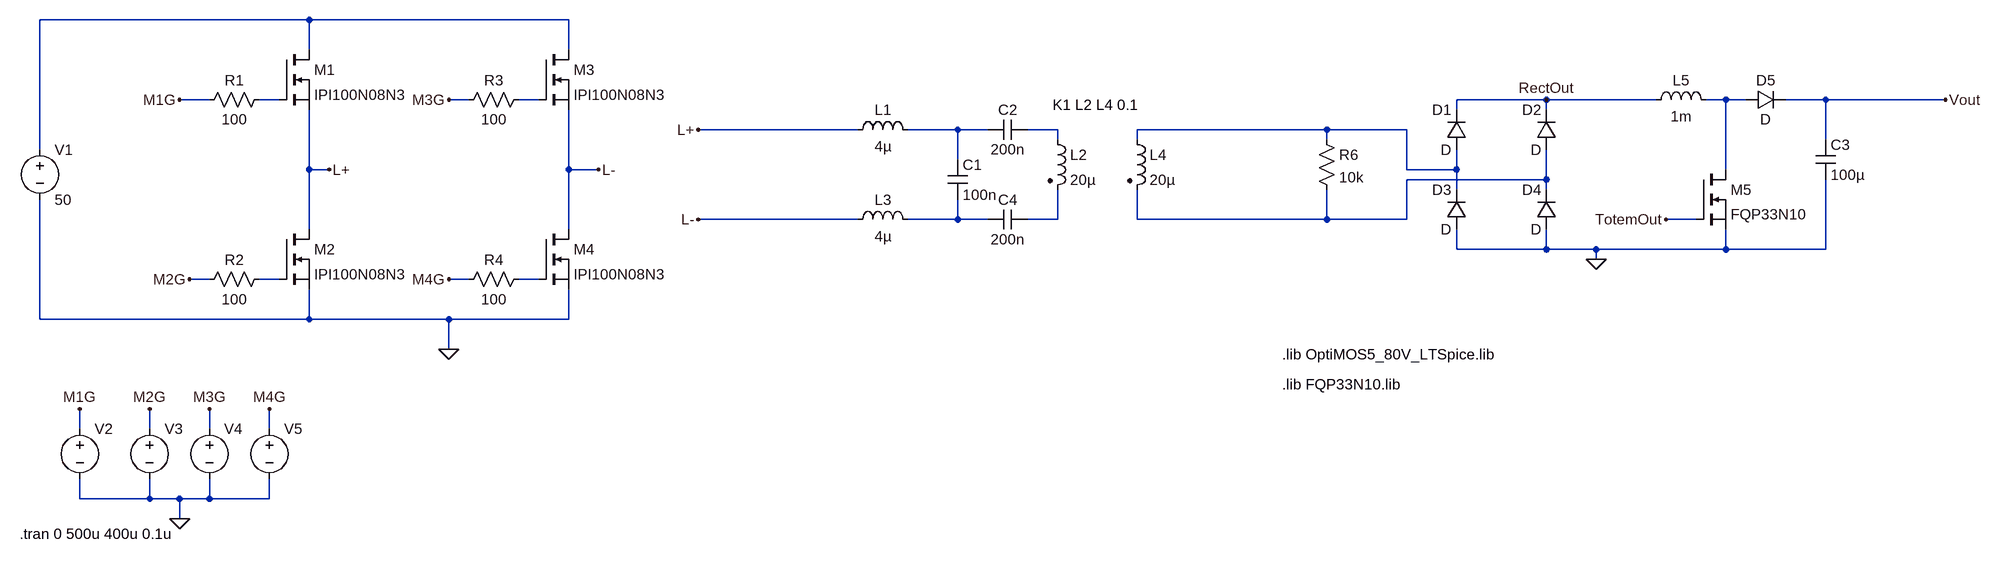
[diagram p0: schematic Inverter&tuning sim (fixed something).asc]
Inverter&tuning sim (fixed something).asc, the LTspice schematic file:
Version 4
SHEET 1 3352 1044
WIRE 176 0 -256 0
WIRE 592 0 176 0
WIRE 176 48 176 0
WIRE 592 48 592 0
WIRE 16 128 -32 128
WIRE 128 128 96 128
WIRE 432 128 400 128
WIRE 544 128 512 128
WIRE 2160 128 2016 128
WIRE 2336 128 2160 128
WIRE 2448 128 2416 128
WIRE 2480 128 2448 128
WIRE 2608 128 2544 128
WIRE 2800 128 2608 128
WIRE 2016 144 2016 128
WIRE 2160 144 2160 128
WIRE 1056 176 800 176
WIRE 1216 176 1136 176
WIRE 1264 176 1216 176
WIRE 1376 176 1328 176
WIRE 1808 176 1504 176
WIRE 1936 176 1808 176
WIRE 1376 192 1376 176
WIRE 1504 192 1504 176
WIRE 1808 192 1808 176
WIRE 2608 192 2608 128
WIRE -256 208 -256 0
WIRE 1216 224 1216 176
WIRE 176 240 176 144
WIRE 208 240 176 240
WIRE 592 240 592 144
WIRE 640 240 592 240
WIRE 1936 240 1936 176
WIRE 2016 240 2016 208
WIRE 2016 240 1936 240
WIRE 2448 240 2448 128
WIRE 2160 256 2160 208
WIRE 2160 256 1936 256
WIRE 2016 272 2016 240
WIRE 2160 272 2160 256
WIRE 1056 320 800 320
WIRE 1216 320 1216 288
WIRE 1216 320 1136 320
WIRE 1264 320 1216 320
WIRE 1376 320 1376 272
WIRE 1376 320 1328 320
WIRE 1504 320 1504 272
WIRE 1808 320 1808 272
WIRE 1808 320 1504 320
WIRE 1936 320 1936 256
WIRE 1936 320 1808 320
WIRE 2400 320 2352 320
WIRE 176 336 176 240
WIRE 592 336 592 240
WIRE 2016 368 2016 336
WIRE 2160 368 2160 336
WIRE 2160 368 2016 368
WIRE 2240 368 2160 368
WIRE 2448 368 2448 336
WIRE 2448 368 2240 368
WIRE 2608 368 2608 256
WIRE 2608 368 2448 368
WIRE 2240 384 2240 368
WIRE 16 416 -16 416
WIRE 128 416 96 416
WIRE 432 416 400 416
WIRE 544 416 512 416
WIRE -256 480 -256 288
WIRE 176 480 176 432
WIRE 176 480 -256 480
WIRE 400 480 176 480
WIRE 592 480 592 432
WIRE 592 480 400 480
WIRE 400 528 400 480
WIRE -192 656 -192 624
WIRE -80 656 -80 624
WIRE 16 656 16 624
WIRE 112 656 112 624
WIRE -192 768 -192 736
WIRE -80 768 -80 736
WIRE -80 768 -192 768
WIRE -32 768 -80 768
WIRE 16 768 16 736
WIRE 16 768 -32 768
WIRE 112 768 112 736
WIRE 112 768 16 768
WIRE -32 800 -32 768
FLAG -192 624 M1G
FLAG -32 128 M1G
FLAG -80 624 M2G
FLAG -16 416 M2G
FLAG 16 624 M3G
FLAG 400 128 M3G
FLAG 112 624 M4G
FLAG 400 416 M4G
FLAG -32 800 0
FLAG 208 240 L+
FLAG 640 240 L-
FLAG 800 176 L+
FLAG 800 320 L-
FLAG 400 528 0
FLAG 2240 384 0
FLAG 2800 128 Vout
FLAG 2160 128 RectOut
FLAG 2352 320 TotemOut
SYMBOL nmos 128 48 R0
SYMATTR InstName M1
SYMATTR Value IPI100N08N3
SYMBOL nmos 128 336 R0
SYMATTR InstName M2
SYMATTR Value IPI100N08N3
SYMBOL nmos 544 48 R0
SYMATTR InstName M3
SYMATTR Value IPI100N08N3
SYMBOL nmos 544 336 R0
SYMATTR InstName M4
SYMATTR Value IPI100N08N3
SYMBOL voltage -256 192 R0
WINDOW 123 0 0 Left 0
WINDOW 39 0 0 Left 0
SYMATTR InstName V1
SYMATTR Value 50
SYMBOL voltage -192 640 R0
WINDOW 3 24 96 Invisible 2
WINDOW 123 0 0 Left 0
WINDOW 39 0 0 Left 0
SYMATTR Value PULSE(0 62 0 1f 1f 2.93333u 6.66667u)
SYMATTR InstName V2
SYMBOL voltage -80 640 R0
WINDOW 3 24 96 Invisible 2
WINDOW 123 0 0 Left 0
WINDOW 39 0 0 Left 0
SYMATTR Value PULSE(0 12 3.33333u 1f 1f 2.93333u 6.66667u)
SYMATTR InstName V3
SYMBOL voltage 112 640 R0
WINDOW 3 24 96 Invisible 2
WINDOW 123 0 0 Left 0
WINDOW 39 0 0 Left 0
SYMATTR Value PULSE(0 12 0 1f 1f 2.93333u 6.66667u)
SYMATTR InstName V5
SYMBOL res 112 112 R90
WINDOW 0 0 56 VBottom 2
WINDOW 3 32 56 VTop 2
SYMATTR InstName R1
SYMATTR Value 100
SYMBOL res 112 400 R90
WINDOW 0 0 56 VBottom 2
WINDOW 3 32 56 VTop 2
SYMATTR InstName R2
SYMATTR Value 100
SYMBOL res 528 112 R90
WINDOW 0 0 56 VBottom 2
WINDOW 3 32 56 VTop 2
SYMATTR InstName R3
SYMATTR Value 100
SYMBOL res 528 400 R90
WINDOW 0 0 56 VBottom 2
WINDOW 3 32 56 VTop 2
SYMATTR InstName R4
SYMATTR Value 100
SYMBOL voltage 16 640 R0
WINDOW 3 24 96 Invisible 2
WINDOW 123 0 0 Left 0
WINDOW 39 0 0 Left 0
SYMATTR Value PULSE(0 62 3.33333u 1f 1f 2.93333u 6.66667u)
SYMATTR InstName V4
SYMBOL ind 1040 192 R270
WINDOW 0 32 56 VTop 2
WINDOW 3 5 56 VBottom 2
SYMATTR InstName L1
SYMATTR Value 4µ
SYMATTR SpiceLine Rser=5m
SYMBOL cap 1200 224 R0
SYMATTR InstName C1
SYMATTR Value 100n
SYMATTR SpiceLine Rser=5m
SYMBOL ind2 1360 176 R0
SYMATTR InstName L2
SYMATTR Value 20µ
SYMATTR SpiceLine Rser=10m
SYMATTR Type ind
SYMBOL cap 1328 160 R90
WINDOW 0 0 32 VBottom 2
WINDOW 3 32 32 VTop 2
SYMATTR InstName C2
SYMATTR Value 200n
SYMATTR SpiceLine Rser=5m
SYMBOL cap 1328 304 R90
WINDOW 0 0 32 VBottom 2
WINDOW 3 32 32 VTop 2
SYMATTR InstName C4
SYMATTR Value 200n
SYMATTR SpiceLine Rser=5m
SYMBOL ind 1040 336 R270
WINDOW 0 32 56 VTop 2
WINDOW 3 5 56 VBottom 2
SYMATTR InstName L3
SYMATTR Value 4µ
SYMATTR SpiceLine Rser=5m
SYMBOL ind2 1488 176 R0
SYMATTR InstName L4
SYMATTR Value 20µ
SYMATTR SpiceLine Rser=10
SYMATTR Type ind
SYMBOL diode 2032 208 R180
WINDOW 0 24 64 Left 2
WINDOW 3 24 0 Left 2
SYMATTR InstName D1
SYMBOL diode 2176 208 R180
WINDOW 0 24 64 Left 2
WINDOW 3 24 0 Left 2
SYMATTR InstName D2
SYMBOL diode 2032 336 R180
WINDOW 0 24 64 Left 2
WINDOW 3 24 0 Left 2
SYMATTR InstName D3
SYMBOL diode 2176 336 R180
WINDOW 0 24 64 Left 2
WINDOW 3 24 0 Left 2
SYMATTR InstName D4
SYMBOL ind 2320 144 R270
WINDOW 0 32 56 VTop 2
WINDOW 3 5 56 VBottom 2
SYMATTR InstName L5
SYMATTR Value 1m
SYMBOL diode 2480 144 R270
WINDOW 0 32 32 VTop 2
WINDOW 3 0 32 VBottom 2
SYMATTR InstName D5
SYMBOL cap 2592 192 R0
SYMATTR InstName C3
SYMATTR Value 100µ
SYMBOL nmos 2400 240 R0
SYMATTR InstName M5
SYMATTR Value FQP33N10
SYMATTR Prefix X
SYMBOL res 1792 176 R0
SYMATTR InstName R6
SYMATTR Value 10k
TEXT -288 824 Left 2 !.tran 0 500u 400u 0.1u
TEXT 1368 136 Left 2 !K1 L2 L4 0.1
TEXT 1736 536 Left 2 !.lib OptiMOS5_80V_LTSpice.lib
TEXT 1736 584 Left 2 !.lib FQP33N10.lib

The netlist it stands for:
* Inverter&tuning sim (fixed something).asc
M1 N001 N002 L+ L+ IPI100N08N3
M2 L+ N011 0 0 IPI100N08N3
M3 N001 N003 L- L- IPI100N08N3
M4 L- N012 0 0 IPI100N08N3
V1 N001 0 50
V2 M1G 0 PULSE(0 62 0 1f 1f 2.93333u 6.66667u)
V3 M2G 0 PULSE(0 12 3.33333u 1f 1f 2.93333u 6.66667u)
V5 M4G 0 PULSE(0 12 0 1f 1f 2.93333u 6.66667u)
R1 N002 M1G 100
R2 N011 M2G 100
R3 N003 M3G 100
R4 N012 M4G 100
V4 M3G 0 PULSE(0 62 3.33333u 1f 1f 2.93333u 6.66667u)
L1 L+ N005 4µ Rser=5m
C1 N005 N009 100n Rser=5m
L2 N006 N010 20µ Rser=10m
C2 N006 N005 200n Rser=5m
C4 N010 N009 200n Rser=5m
L3 L- N009 4µ Rser=5m
L4 N007 N008 20µ Rser=10
D1 N007 RectOut D
D2 N008 RectOut D
D3 0 N007 D
D4 0 N008 D
L5 RectOut N004 1m
D5 N004 Vout D
C3 Vout 0 100µ
XM5 N004 TotemOut 0 FQP33N10  ; pins D G S
R6 N007 N008 10k
.model D D
.lib standard.dio
.model NMOS NMOS
.model PMOS PMOS
.lib standard.mos
.tran 0 500u 400u 0.1u
K1 L2 L4 0.1
.lib OptiMOS5_80V_LTSpice.lib
.lib FQP33N10.lib
.backanno
.end